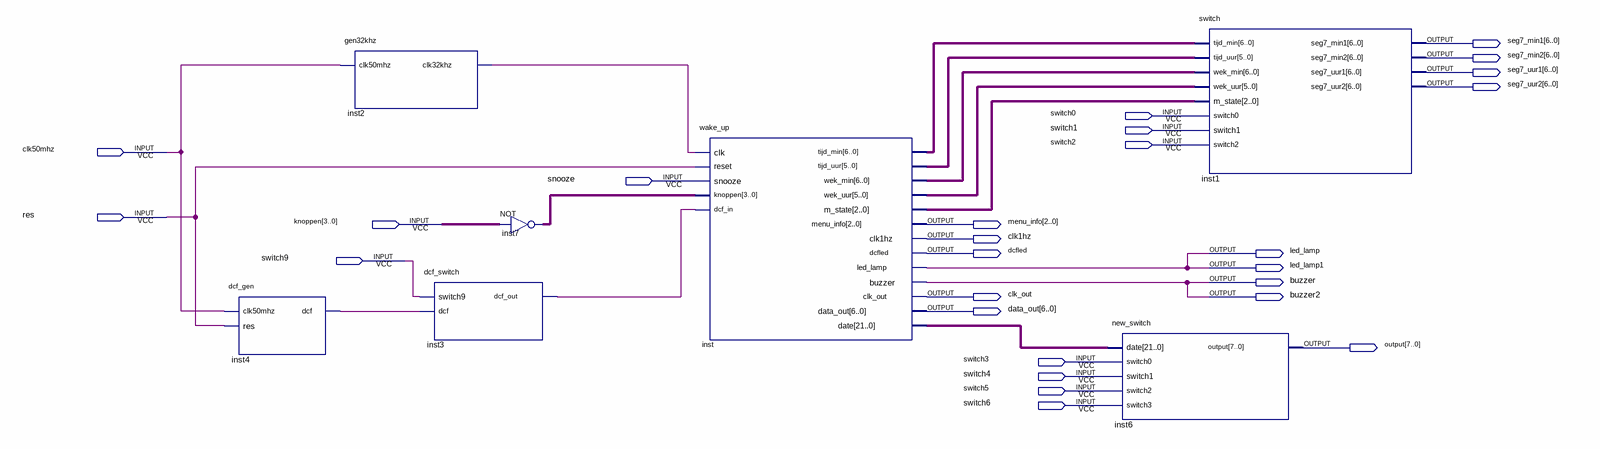
[diagram p0: schematic sheet]
// Quartus schematic Final.bdf as structural Verilog: 7 symbols, 26 pins
module Final (
  input  switch0,
  input  switch1,
  input  switch2,
  input  clk50mhz,
  input  snooze,
  input  res,
  input  [3:0] knoppen,
  input  switch9,
  input  switch3,
  input  switch4,
  input  switch5,
  input  switch6,
  output [6:0] seg7_min1,
  output [6:0] seg7_min2,
  output [6:0] seg7_uur1,
  output [6:0] seg7_uur2,
  output [2:0] menu_info,
  output clk1hz,
  output dcfled,
  output led_lamp,
  output led_lamp1,
  output buzzer,
  output clk_out,
  output buzzer2,
  output [6:0] data_out,
  output [7:0] \output 
);

  wire inst2_clk32khz, inst3_dcf_out, inst4_dcf;
  wire [2:0] inst_m_state;
  wire [3:0] inst7_out;
  wire [5:0] inst_tijd_uur, inst_wek_uur;
  wire [6:0] inst_tijd_min, inst_wek_min;
  wire [21:0] inst_date;

  dcf_gen inst4 (.clk50mhz(clk50mhz), .res(res), .dcf(inst4_dcf));
  gen32khz inst2 (.clk50mhz(clk50mhz), .clk32khz(inst2_clk32khz));
  dcf_switch inst3 (.switch9(switch9), .dcf(inst4_dcf), .dcf_out(inst3_dcf_out));
  assign inst7_out = ~knoppen;  // NOT inst7, 4 bits wide
  wake_up inst (
    .clk(inst2_clk32khz), .reset(res), .snooze(snooze), .knoppen(inst7_out), .dcf_in(inst3_dcf_out),
    .tijd_min(inst_tijd_min), .tijd_uur(inst_tijd_uur), .wek_min(inst_wek_min), .wek_uur(inst_wek_uur),
    .m_state(inst_m_state), .menu_info(menu_info), .clk1hz(clk1hz), .dcfled(dcfled), .led_lamp(led_lamp),
    .buzzer(buzzer), .clk_out(clk_out), .data_out(data_out), .date(inst_date));
  new_switch inst6 (
    .date(inst_date), .switch0(switch3), .switch1(switch4), .switch2(switch5), .switch3(switch6),
    .\output (\output ));
  switch inst1 (
    .tijd_min(inst_tijd_min), .tijd_uur(inst_tijd_uur), .wek_min(inst_wek_min), .wek_uur(inst_wek_uur),
    .m_state(inst_m_state), .switch0(switch0), .switch1(switch1), .switch2(switch2), .seg7_min1(seg7_min1),
    .seg7_min2(seg7_min2), .seg7_uur1(seg7_uur1), .seg7_uur2(seg7_uur2));

  assign buzzer2 = buzzer;
  assign led_lamp1 = led_lamp;
endmodule
